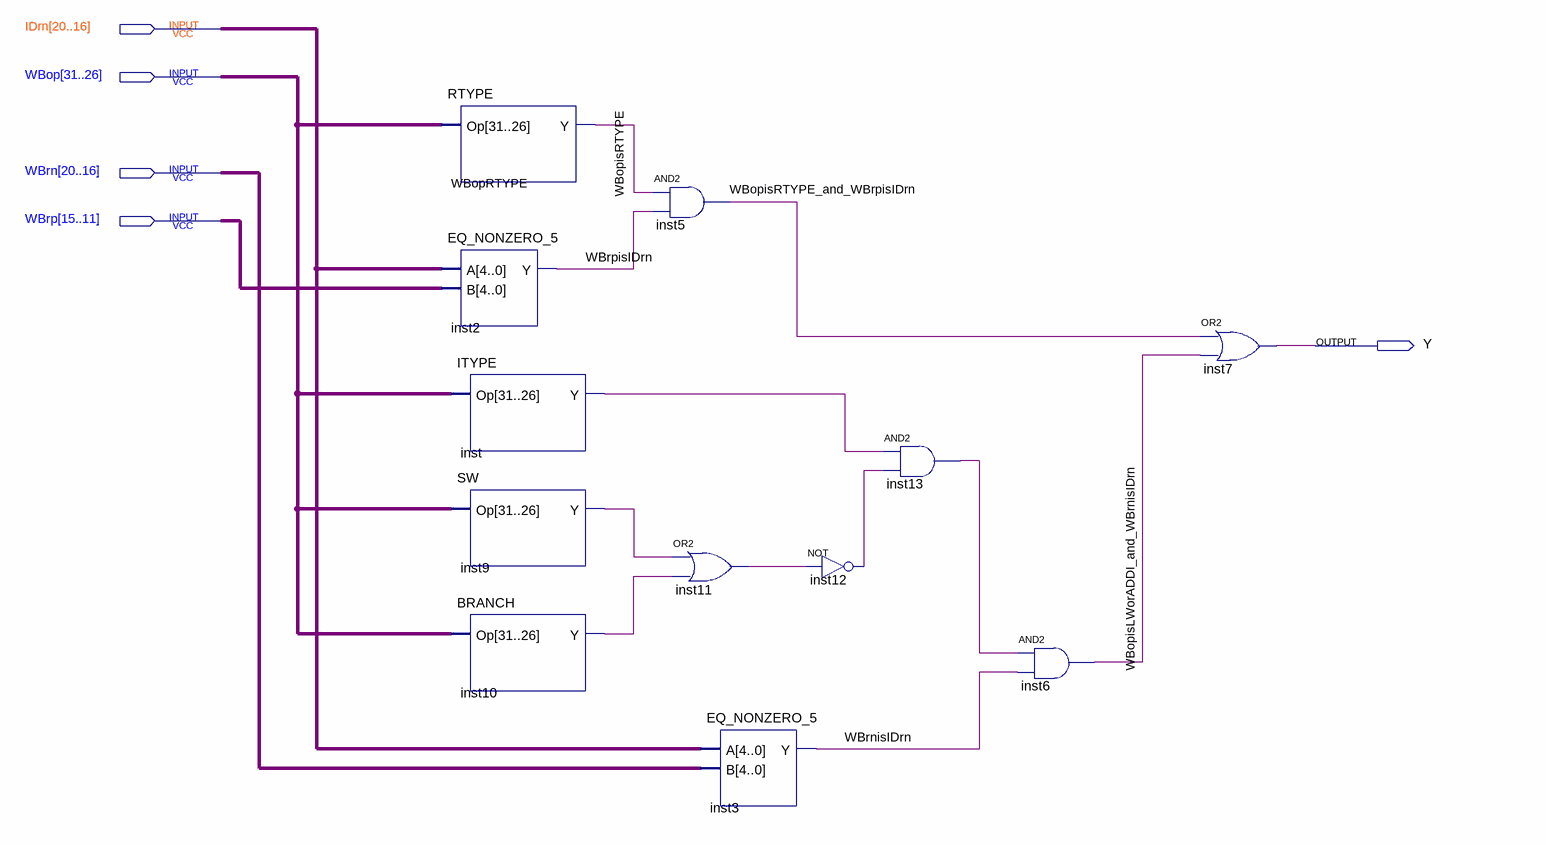
[diagram p0: schematic sheet]
// Quartus schematic ForwardBfromWBtoID.bdf as structural Verilog: 12 symbols, 5 pins
module ForwardBfromWBtoID (
  input  [20:16] IDrn,
  input  [31:26] WBop,
  input  [20:16] WBrn,
  input  [15:11] WBrp,
  output Y
);

  wire inst9_y, inst10_y, inst11_out, inst12_out, inst13_out, inst_y, WBopisLWorADDI_and_WBrnisIDrn,
       WBopisRTYPE, WBopisRTYPE_and_WBrpisIDrn, WBrnisIDrn, WBrpisIDrn;

  RTYPE WBopRTYPE (.Op(WBop), .Y(WBopisRTYPE));
  EQ_NONZERO_5 inst2 (.A(IDrn), .B(WBrp), .Y(WBrpisIDrn));
  ITYPE inst (.Op(WBop), .Y(inst_y));
  SW inst9 (.Op(WBop), .Y(inst9_y));
  BRANCH inst10 (.Op(WBop), .Y(inst10_y));
  and inst5 (WBopisRTYPE_and_WBrpisIDrn, WBopisRTYPE, WBrpisIDrn);
  or inst11 (inst11_out, inst9_y, inst10_y);
  EQ_NONZERO_5 inst3 (.A(IDrn), .B(WBrn), .Y(WBrnisIDrn));
  not inst12 (inst12_out, inst11_out);
  and inst13 (inst13_out, inst_y, inst12_out);
  and inst6 (WBopisLWorADDI_and_WBrnisIDrn, inst13_out, WBrnisIDrn);
  or inst7 (Y, WBopisRTYPE_and_WBrpisIDrn, WBopisLWorADDI_and_WBrnisIDrn);
endmodule
